# Altium schematic sheet CIV.SchDoc
size C
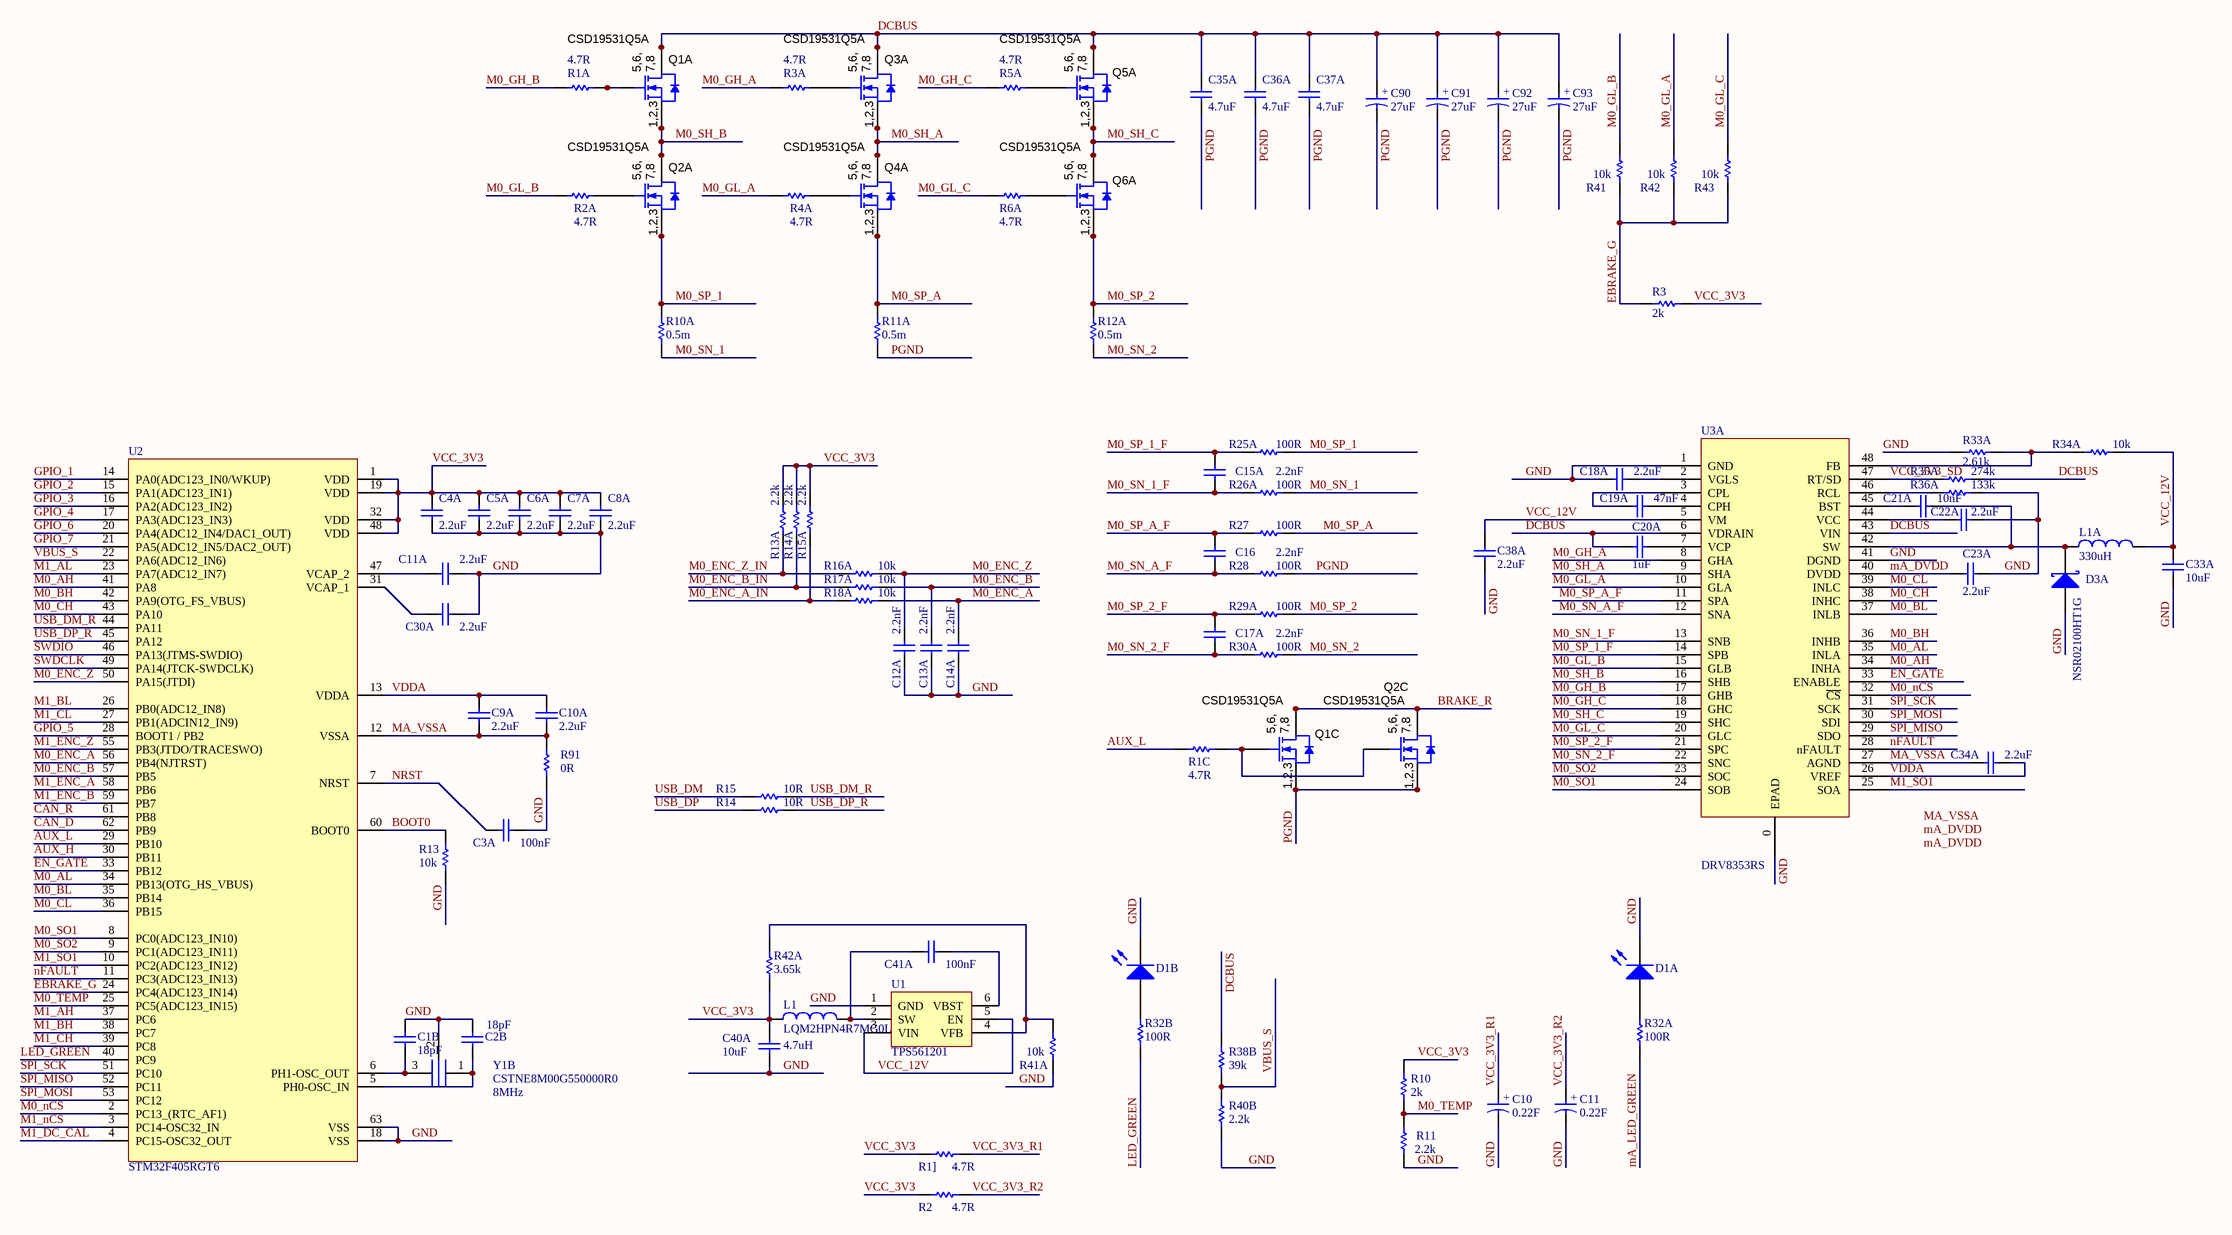
[diagram p0: CIV.SchDoc]

## Parts
C1B  value 18pF  [CAP 0402]  (hidden comment: GCM1555C1H180JA16D)
C2B  value 18pF  [CAP 0402]  (hidden comment: GCM1555C1H180JA16D)
C3A  value 100nF  [CAP 0402]  (hidden comment: C0402C104K3RACTU)
C4A  value 2.2uF  [CAP 0402]  (hidden comment: GRM155C81C225ME15D)
C5A  value 2.2uF  [CAP 0402]  (hidden comment: GRM155C81C225ME15D)
C6A  value 2.2uF  [CAP 0402]  (hidden comment: GRM155C81C225ME15D)
C7A  value 2.2uF  [CAP 0402]  (hidden comment: GRM155C81C225ME15D)
C8A  value 2.2uF  [CAP 0402]  (hidden comment: GRM155C81C225ME15D)
C9A  value 2.2uF  [CAP 0402]  (hidden comment: GRM155C81C225ME15D)
C10  value 0.22F  [DSK-621]  (hidden comment: DSK-3R3H224U-HL)
C10A  value 2.2uF  [CAP 0402]  (hidden comment: GRM155C81C225ME15D)
C11  value 0.22F  [DSK-621]  (hidden comment: DSK-3R3H224U-HL)
C11A  value 2.2uF  [CAP 0402]  (hidden comment: GRM155C81C225ME15D)
C12A  value 2.2nF  [CAP 0402]  (hidden comment: GCM155R72A222KA37D)
C13A  value 2.2nF  [CAP 0402]  (hidden comment: GCM155R72A222KA37D)
C14A  value 2.2nF  [CAP 0402]  (hidden comment: GCM155R72A222KA37D)
C15A  value 2.2nF  [CAP 0402]  (hidden comment: GCM155R72A222KA37D)
C16  value 2.2nF  [CAP 0402]  (hidden comment: GCM155R72A222KA37D)
C17A  value 2.2nF  [CAP 0402]  (hidden comment: GCM155R72A222KA37D)
C18A  value 2.2uF  [CAP 0402]  (hidden comment: GRM155C81C225ME15D)
C19A  value 47nF  [CAP 0603]  (hidden comment: C0603C473K1RECAUTO)
C20A  value 1uF  [CAP 0402]  (hidden comment: C0402C105K4PACTU)
C21A  value 10nF  [CAP 0402]  (hidden comment: GCM155R71E103JA37D)
C22A  value 2.2uF  [CAP 0402]  (hidden comment: GRM155C81C225ME15D)
C23A  value 2.2uF  [CAP 0402]  (hidden comment: GRM155C81C225ME15D)
C30A  value 2.2uF  [CAP 0402]  (hidden comment: GRM155C81C225ME15D)
C33A  value 10uF  [CAP 1206]  (hidden comment: TMK316AB7106KL-T)
C34A  value 2.2uF  [CAP 0402]  (hidden comment: GRM155C81C225ME15D)
C35A  value 4.7uF  [CAP 1210]  (hidden comment: CGA6M3X7S2A475M200AB)
C36A  value 4.7uF  [CAP 1210]  (hidden comment: CGA6M3X7S2A475M200AB)
C37A  value 4.7uF  [CAP 1210]  (hidden comment: CGA6M3X7S2A475M200AB)
C38A  value 2.2uF  [CAP 0402]  (hidden comment: GRM155C81C225ME15D)
C40A  value 10uF  [CAP 1206]  (hidden comment: TMK316AB7106KL-T)
C41A  value 100nF  [CAP 0402]  (hidden comment: C0402C104K3RACTU)
C90  value 27uF  [Panasonic F]  (hidden comment: 100SXV15M)
C91  value 27uF  [Panasonic F]  (hidden comment: 100SXV15M)
C92  value 27uF  [Panasonic F]  (hidden comment: 100SXV15M)
C93  value 27uF  [Panasonic F]  (hidden comment: 100SXV15M)
D1A  LTST-C190KRKT  [LED 0603]  (value not drawn)
D1B  LTST-C190KRKT  [LED 0603]  (value not drawn)
D3A  NSR02100HT1G  [SOD-323/SC76]
L1  LQM2HPN4R7MG0L  value 4.7uH  [IND 1008]
L1A  value 330uH  [SDE0805A]  (hidden comment: SDE0805A-331K)
Q1A  CSD19531Q5A  [VSONP-8]
Q1C  CSD19531Q5A  [VSONP-8]
Q2A  CSD19531Q5A  [VSONP-8]
Q2C  CSD19531Q5A  [VSONP-8]
Q3A  CSD19531Q5A  [VSONP-8]
Q4A  CSD19531Q5A  [VSONP-8]
Q5A  CSD19531Q5A  [VSONP-8]
Q6A  CSD19531Q5A  [VSONP-8]
R1]  value 4.7R  [RES 0402]  (hidden comment: ERJ-PA3J4R7V)
R1A  value 4.7R  [RES 0402]  (hidden comment: ERJ-PA3J4R7V)
R1C  value 4.7R  [RES 0402]  (hidden comment: ERJ-PA3J4R7V)
R2  value 4.7R  [RES 0402]  (hidden comment: ERJ-PA3J4R7V)
R2A  value 4.7R  [RES 0402]  (hidden comment: ERJ-PA3J4R7V)
R3  value 2k  [RES 0402]  (hidden comment: ERT-J0EG202GM)
R3A  value 4.7R  [RES 0402]  (hidden comment: ERJ-PA3J4R7V)
R4A  value 4.7R  [RES 0402]  (hidden comment: ERJ-PA3J4R7V)
R5A  value 4.7R  [RES 0402]  (hidden comment: ERJ-PA3J4R7V)
R6A  value 4.7R  [RES 0402]  (hidden comment: ERJ-PA3J4R7V)
R10  value 2k  [RES 0402]  (hidden comment: ERT-J0EG202GM)
R10A  0.5m  [RES 2512]
R11  value 2.2k  [RES 0402]  (hidden comment: ERJ-2RKF2201X)
R11A  0.5m  [RES 2512]
R12A  0.5m  [RES 2512]
R13  value 10k  [RES 0402]  (hidden comment: ERJ-2RKF1002X)
R13A  value 2.2k  [RES 0402]  (hidden comment: ERJ-2RKF2201X)
R14  value 10R  [RES 0402]  (hidden comment: ERJ-2RKF10R0X)
R14A  value 2.2k  [RES 0402]  (hidden comment: ERJ-2RKF2201X)
R15  value 10R  [RES 0402]  (hidden comment: ERJ-2RKF10R0X)
R15A  value 2.2k  [RES 0402]  (hidden comment: ERJ-2RKF2201X)
R16A  value 10k  [RES 0402]  (hidden comment: ERJ-2RKF1002X)
R17A  value 10k  [RES 0402]  (hidden comment: ERJ-2RKF1002X)
R18A  value 10k  [RES 0402]  (hidden comment: ERJ-2RKF1002X)
R25A  value 100R  [RES 0402]  (hidden comment: ERJ-2RKF1000X)
R26A  value 100R  [RES 0402]  (hidden comment: ERJ-2RKF1000X)
R27  value 100R  [RES 0402]  (hidden comment: ERJ-2RKF1000X)
R28  value 100R  [RES 0402]  (hidden comment: ERJ-2RKF1000X)
R29A  value 100R  [RES 0402]  (hidden comment: ERJ-2RKF1000X)
R30A  value 100R  [RES 0402]  (hidden comment: ERJ-2RKF1000X)
R32A  value 100R  [RES 0402]  (hidden comment: ERJ-2RKF1000X)
R32B  value 100R  [RES 0402]  (hidden comment: ERJ-2RKF1000X)
R33A  value 2.61k  [RES 0402]  (hidden comment: ERJ-2RKF2611X)
R34A  value 10k  [RES 0402]  (hidden comment: ERJ-2RKF1002X)
R35A  value 274k  [RES 0402]  (hidden comment: ERJ-2RKF2743X)
R36A  value 133k  [RES 0402]  (hidden comment: ERJ-2RKF1333X)
R38B  value 39k  [RES 0402]  (hidden comment: ERJ-2RKF3902X)
R40B  value 2.2k  [RES 0402]  (hidden comment: ERJ-2RKF2201X)
R41  value 10k  [RES 0402]  (hidden comment: ERJ-2RKF1002X)
R41A  value 10k  [RES 0402]  (hidden comment: ERJ-2RKF1002X)
R42  value 10k  [RES 0402]  (hidden comment: ERJ-2RKF1002X)
R42A  value 3.65k  [RES 0402]  (hidden comment: ERJ-2RKF3651X)
R43  value 10k  [RES 0402]  (hidden comment: ERJ-2RKF1002X)
R91  value 0R  [RES 0402]  (hidden comment: ERJ-2GE0R00X)
U1  TPS561201  [SOT-23-6]
U2  STM32F405RGT6  [QFP-64 - P0.5MM]
U3A  DRV8353RS  [QFN-48 - P0.5MM]
Y1B  CSTNE8M00G550000R0  value 8MHz  [MuRata CSTN]

## Nets
AUX_H: U2.30(PB11)
AUX_L: R1C.1 U2.29(PB10)
BOOT0: R13.2 U2.60(BOOT0)
BRAKE_R: Q1C.5(D) Q1C.6(D) Q1C.7(D) Q1C.8(D) Q1C.9(D) Q2C.5(D) Q2C.6(D) Q2C.7(D) Q2C.8(D) Q2C.9(D)
CAN_D: U2.62(PB9)
CAN_R: U2.61(PB8)
DCBUS: C20A.1 C35A.2 C36A.2 C37A.2 C90.2 C91.2 C92.2 C93.2 Q1A.5(D) Q1A.6(D) Q1A.7(D) Q1A.8(D) Q1A.9(D) Q3A.5(D) Q3A.6(D) Q3A.7(D) Q3A.8(D) Q3A.9(D) Q5A.5(D) Q5A.6(D) Q5A.7(D) Q5A.8(D) Q5A.9(D) R35A.2 R38B.2 U3A.6(VDRAIN) U3A.43(VIN)
EBRAKE_G: R3.2 R41.1 R42.1 R43.1 U2.24(PC4(ADC123_IN14))
EN_GATE: U2.33(PB12) U3A.33(ENABLE)
GND: C1B.2 C2B.2 C3A.2 C4A.2 C5A.2 C6A.2 C7A.2 C8A.2 C10.1 C11.1 C11A.2 C12A.1 C13A.1 C14A.1 C18A.2 C22A.1 C23A.1 C30A.2 C33A.2 C38A.2 C40A.2 D1A.2(K) D1B.2(K) D3A.1(A) R11.1 R13.1 R33A.1 R36A.2 R40B.1 R41A.1 R91.1 U1.1(GND) U2.18(VSS) U2.63(VSS) U3A.0(EPAD) U3A.1(GND) U3A.41(DGND) Y1B.2
GPIO_1: U2.14(PA0(ADC123_IN0/WKUP))
GPIO_2: U2.15(PA1(ADC123_IN1))
GPIO_3: U2.16(PA2(ADC123_IN2))
GPIO_4: U2.17(PA3(ADC123_IN3))
GPIO_5: U2.28(BOOT1_/_PB2)
GPIO_6: U2.20(PA4(ADC12_IN4/DAC1_OUT))
GPIO_7: U2.21(PA5(ADC12_IN5/DAC2_OUT))
LED_GREEN: R32B.2 U2.40(PC9)
M0_AH: U2.41(PA8) U3A.34(INHA)
M0_AL: U2.34(PB13(OTG_HS_VBUS)) U3A.35(INLA)
M0_BH: U2.42(PA9(OTG_FS_VBUS)) U3A.36(INHB)
M0_BL: U2.35(PB14) U3A.37(INLB)
M0_CH: U2.43(PA10) U3A.38(INHC)
M0_CL: U2.36(PB15) U3A.39(INLC)
M0_ENC_A: C14A.2 R18A.2 U2.56(PB4(NJTRST))
M0_ENC_A_IN: R15A.1 R18A.1
M0_ENC_B: C13A.2 R17A.2 U2.57(PB5)
M0_ENC_B_IN: R14A.1 R17A.1
M0_ENC_Z: C12A.2 R16A.2 U2.50(PA15(JTDI))
M0_ENC_Z_IN: R13A.1 R16A.1
M0_GH_A: R3A.1 U3A.8(GHA)
M0_GH_B: R1A.1 U3A.17(GHB)
M0_GH_C: R5A.1 U3A.18(GHC)
M0_GL_A: R4A.1 R42.2 U3A.10(GLA)
M0_GL_B: R2A.1 R41.2 U3A.15(GLB)
M0_GL_C: R6A.1 R43.2 U3A.20(GLC)
M0_nCS: U2.2(PC13_(RTC_AF1)) U3A.32(~{CS})
M0_SH_A: Q3A.1(S) Q3A.2(S) Q3A.3(S) Q4A.5(D) Q4A.6(D) Q4A.7(D) Q4A.8(D) Q4A.9(D) U3A.9(SHA)
M0_SH_B: Q1A.1(S) Q1A.2(S) Q1A.3(S) Q2A.5(D) Q2A.6(D) Q2A.7(D) Q2A.8(D) Q2A.9(D) U3A.16(SHB)
M0_SH_C: Q5A.1(S) Q5A.2(S) Q5A.3(S) Q6A.5(D) Q6A.6(D) Q6A.7(D) Q6A.8(D) Q6A.9(D) U3A.19(SHC)
M0_SN_1: R10A.1 R26A.2
M0_SN_1_F: C15A.1 R26A.1 U3A.13(SNB)
M0_SN_2: R12A.2 R30A.2
M0_SN_2_F: C17A.1 R30A.1 U3A.22(SNC)
M0_SN_A_F: C16.1 R28.1 U3A.12(SNA)
M0_SO1: U2.8(PC0(ADC123_IN10)) U3A.24(SOB)
M0_SO2: U2.9(PC1(ADC123_IN11)) U3A.23(SOC)
M0_SP_1: Q2A.1(S) Q2A.2(S) Q2A.3(S) R10A.2 R25A.2
M0_SP_1_F: C15A.2 R25A.1 U3A.14(SPB)
M0_SP_2: Q6A.1(S) Q6A.2(S) Q6A.3(S) R12A.1 R29A.2
M0_SP_2_F: C17A.2 R29A.1 U3A.21(SPC)
M0_SP_A: Q4A.1(S) Q4A.2(S) Q4A.3(S) R11A.2 R27.2
M0_SP_A_F: C16.2 R27.1 U3A.11(SPA)
M0_TEMP: R10.1 R11.2 U2.25(PC5(ADC123_IN15))
M1_AH: U2.37(PC6)
M1_AL: U2.23(PA7(ADC12_IN7))
M1_BH: U2.38(PC7)
M1_BL: U2.26(PB0(ADC12_IN8))
M1_CH: U2.39(PC8)
M1_CL: U2.27(PB1(ADCIN12_IN9))
M1_DC_CAL: U2.4(PC15-OSC32_OUT)
M1_ENC_A: U2.58(PB6)
M1_ENC_B: U2.59(PB7)
M1_ENC_Z: U2.55(PB3(JTDO/TRACESWO))
M1_nCS: U2.3(PC14-OSC32_IN)
M1_SO1: U2.10(PC2(ADC123_IN12)) U3A.25(SOA)
mA_DVDD: C23A.2 U3A.40(DVDD)
mA_LED_GREEN: R32A.2
MA_VSSA: C9A.2 C10A.2 C34A.2 R91.2 U2.12(VSSA) U3A.27(AGND)
nFAULT: U2.11(PC3(ADC123_IN13)) U3A.28(nFAULT)
NRST: C3A.1 U2.7(NRST)
PGND: C35A.1 C36A.1 C37A.1 C90.1 C91.1 C92.1 C93.1 Q1C.1(S) Q1C.2(S) Q1C.3(S) Q2C.1(S) Q2C.2(S) Q2C.3(S) R11A.1 R28.2
SPI_MISO: U2.52(PC11) U3A.29(SDO)
SPI_MOSI: U2.53(PC12) U3A.30(SDI)
SPI_SCK: U2.51(PC10) U3A.31(SCK)
SWDCLK: U2.49(PA14(JTCK-SWDCLK))
SWDIO: U2.46(PA13(JTMS-SWDIO))
USB_DM: R15.1
USB_DM_R: R15.2 U2.44(PA11)
USB_DP: R14.1
USB_DP_R: R14.2 U2.45(PA12)
VBUS_S: R38B.1 R40B.2 U2.22(PA6(ADC12_IN6))
VCC_3V3: C4A.1 C5A.1 C6A.1 C7A.1 C8A.1 C40A.1 L1.1 R1].1 R2.1 R3.1 R10.2 R13A.2 R14A.2 R15A.2 R42A.1 U2.1(VDD) U2.19(VDD) U2.32(VDD) U2.48(VDD)
VCC_3V3_R1: C10.2 R1].2
VCC_3V3_R2: C11.2 R2.2
VCC_3V3_SD: R35A.1 U3A.47(RT/SD)
VCC_12V: C33A.1 C38A.1 L1A.2 R34A.2 U1.3(VIN) U1.5(EN) U3A.5(VM)
VDDA: C9A.1 C10A.1 C34A.1 U2.13(VDDA) U3A.26(VREF)
NetC1B_1: C1B.1 U2.6(PH1-OSC_OUT) Y1B.3
NetC2B_1: C2B.1 U2.5(PH0-OSC_IN) Y1B.1
NetC11A_1: C11A.1 U2.47(VCAP_2)
NetC18A_1: C18A.1 U3A.2(VGLS)
NetC19A_1: C19A.1 U3A.3(CPL)
NetC19A_2: C19A.2 U3A.4(CPH)
NetC20A_2: C20A.2 U3A.7(VCP)
NetC21A_1: C21A.1 U3A.45(BST)
NetC21A_2: C21A.2 D3A.2(K) L1A.1 U3A.42(SW)
NetC22A_2: C22A.2 U3A.44(VCC)
NetC30A_1: C30A.1 U2.31(VCAP_1)
NetC41A_1: C41A.1 L1.2 U1.2(SW)
NetC41A_2: C41A.2 U1.6(VBST)
NetD1A_1: D1A.1(A) R32A.1
NetD1B_1: D1B.1(A) R32B.1
NetQ1A_4: Q1A.4(G) R1A.2
NetQ1C_4: Q1C.4(G) Q2C.4(G) R1C.2
NetQ2A_4: Q2A.4(G) R2A.2
NetQ3A_4: Q3A.4(G) R3A.2
NetQ4A_4: Q4A.4(G) R4A.2
NetQ5A_4: Q5A.4(G) R5A.2
NetQ6A_4: Q6A.4(G) R6A.2
NetR33A_2: R33A.2 R34A.1 U3A.48(FB)
NetR36A_1: R36A.1 U3A.46(RCL)
NetR41A_2: R41A.2 R42A.2 U1.4(VFB)

## Notes on the sheet
- Labels drawn without touching a wire or pin: mA_DVDD, MA_VSSA
- (in symbol 100SXV15M) +
- (in symbol CSD19531Q5A) 5,6,; 7,8; 1,2,3
- (in symbol DSK-3R3H224U-HL) +

## Library data of the parts
C1B C2B = GCM1555C1H180JA16D: CAP 0402 18pF 50V (NP0 Dielectric); WVDC: 50
C3A C41A = C0402C104K3RACTU: CAP 0402 100nF 10V; WVDC: 25
C4A C5A C6A C7A C8A C9A C10A C11A C18A C22A C23A C30A C34A C38A = GRM155C81C225ME15D: CAP 0402 2.2uF 16V; WVDC: 16
C10 C11 = DSK-3R3H224U-HL: Supercapacitors / Ultracapacitors 3.3V .22F 6.8x2.1; WVDC: 3.3
C12A C13A C14A C15A C16 C17A = GCM155R72A222KA37D: CAP 0402 2.2nF 100V (X7R DIELECTRIC); WVDC: 100
C19A = C0603C473K1RECAUTO: CAP 0603 47nF 100V (X7R DIELECTRIC); WVDC: 100
C20A = C0402C105K4PACTU: CAP 0402 1uF 16V; WVDC: 16
C21A = GCM155R71E103JA37D: CAP 0402 10nF 25V; WVDC: 25
C33A C40A = TMK316AB7106KL-T: CAP 1206 10uF 25V; WVDC: 25
C35A C36A C37A = CGA6M3X7S2A475M200AB: CAP 1206 4.7uF 100V; WVDC: 100
C90-C93 = 100SXV15M: Aluminum Organic Polymer Capacitors 100volt 15uF 40mOhm 8x12mm OS-CON; WVDC: 100
D1A D1B = LTST-C190KRKT: RED LED
D3A = NSR02100HT1G: Schottky Diodes & Rectifiers 100V; Vrrm: 100; If: 200mA
L1 = LQM2HPN4R7MG0L: Fixed Inductors 1008 4.7uH 20% 1.1A
L1A = SDE0805A-331K: Fixed Inductors 330uH 10% SMD 0805 AEC-Q200; Isat: 400mA
Q1A Q1C Q2A Q2C Q3A Q4A Q5A Q6A = CSD19531Q5A: 100V 100A VSONP-8 5.3mOhm Pwr MOSFET; Manufacturer: Texas Instruments; Value2: 48 nC; QgTyp_nC: 48; SizeAreaWB_mm2: 56; SizeArea_mm2: 30; SizeX_mm: 6; SizeY_mm: 5; SizeZ_mm: 1; PartNumber: CSD19531Q5A; Value: 100V; VdsMax_V: 100V; Vgs_V: 100V; IdsMax_A: 100A; RoHS: Y; ComponentLink1Description: Datasheet link
R1] R1A R1C R2 R2A R3A R4A R5A R6A = ERJ-PA3J4R7V: RES 0402 4.7R 5%
R3 R10 = ERT-J0EG202GM: NTC THERMISTOR 0402 2k 2%
R10A R11A R12A = CSR2512C0R0005F: RES SMD 0.0005 OHM 1% 3W 2512; Manufacturer: Riedon; Temperature Coefficient: ±100ppm/°C; Supplier 1: Digi-Key; Supplier Part Number 1: 696-1183-2-ND; RoHS: RoHS Compliant; Category: Resistors; Stock: 2000; Pricing 1: 2000=0.19817, 6000=0.1937, 10000=0.187, 50000=0.18148 (USD); Packaging: Tape & Reel (TR); Part Status: Active; Tolerance: ±1%; Power (Watts): 3W; Composition: Metal Element; Features: Current Sense; Operating Temperature: -55°C ~ 170°C; Package / Case: 2512 (6432 Metric); Supplier Device Package: 2512; Size / Dimension: 0.250" L x 0.118" W (6.35mm x 3.00mm); Height - Seated (Max): 0.057" (1.45mm); Failure Rate: -; ComponentLink1URL: http://riedon.com/media/pdf/CSR.pdf; ComponentLink1Description: http://riedon.com/media/pdf/CSR.pdf; Supplier 2: Digi-Key; Supplier Part Number 2: 696-1183-1-ND; Pricing 2: 1=0.69, 10=0.574, 25=0.4916, 50=0.4426, 100=0.3852, 250=0.3442, 500=0.27864, 1000=0.22536 (USD); Manufacturer Part Number: CSR2512C0R0005F
R11 R13A R14A R15A R40B = ERJ-2RKF2201X: RES 0402 2.2k 1%
R13 R16A R17A R18A R34A R41 R41A R42 R43 = ERJ-2RKF1002X: RES 0402 10k 1%
R14 R15 = ERJ-2RKF10R0X: RES 0402 10R 1%
R25A R26A R27 R28 R29A R30A R32A R32B = ERJ-2RKF1000X: RES 0402 100R 1%
R33A = ERJ-2RKF2611X: RES 0402 2.61k 1%
R35A = ERJ-2RKF2743X: RES 0402 274k 1%
R36A = ERJ-2RKF1333X: RES 0402 133k 1%
R38B = ERJ-2RKF3902X: RES 0402 39k 1%
R42A = ERJ-2RKF3651X: RES 0402 3.65k 1%
R91 = ERJ-2GE0R00X: RES 0402 0R
U1 = TPS561201: 4.5V to 17V Input, 1A Synchronous Step-Down Voltage Regulator in 6-pin SOT-23
U2 = STM32F405RGT6(V2): Cortex M4 MCU
U3A = DRV8353RS: 100V Three Phase Gate Driver With 3 Current Shunt Amplifiers and Buck Regulator (SPI)
Y1B = CSTNE8M00G550000R0: Ceramic Resonator 8.0000MHz 33pf 0.5%